# Altium schematic sheet fpga-bank6.SchDoc: FPGA - Bank 6
size Letter; CompanyName: Brinton Engineering, LLC; Address1: 3479 Edison Way; Address2: Menlo Park CA 94025; Address3: +1 (877) 778-8435; Address4: brintonengineering.com; Revision: 1; SheetNumber: 1; SheetTotal: 1
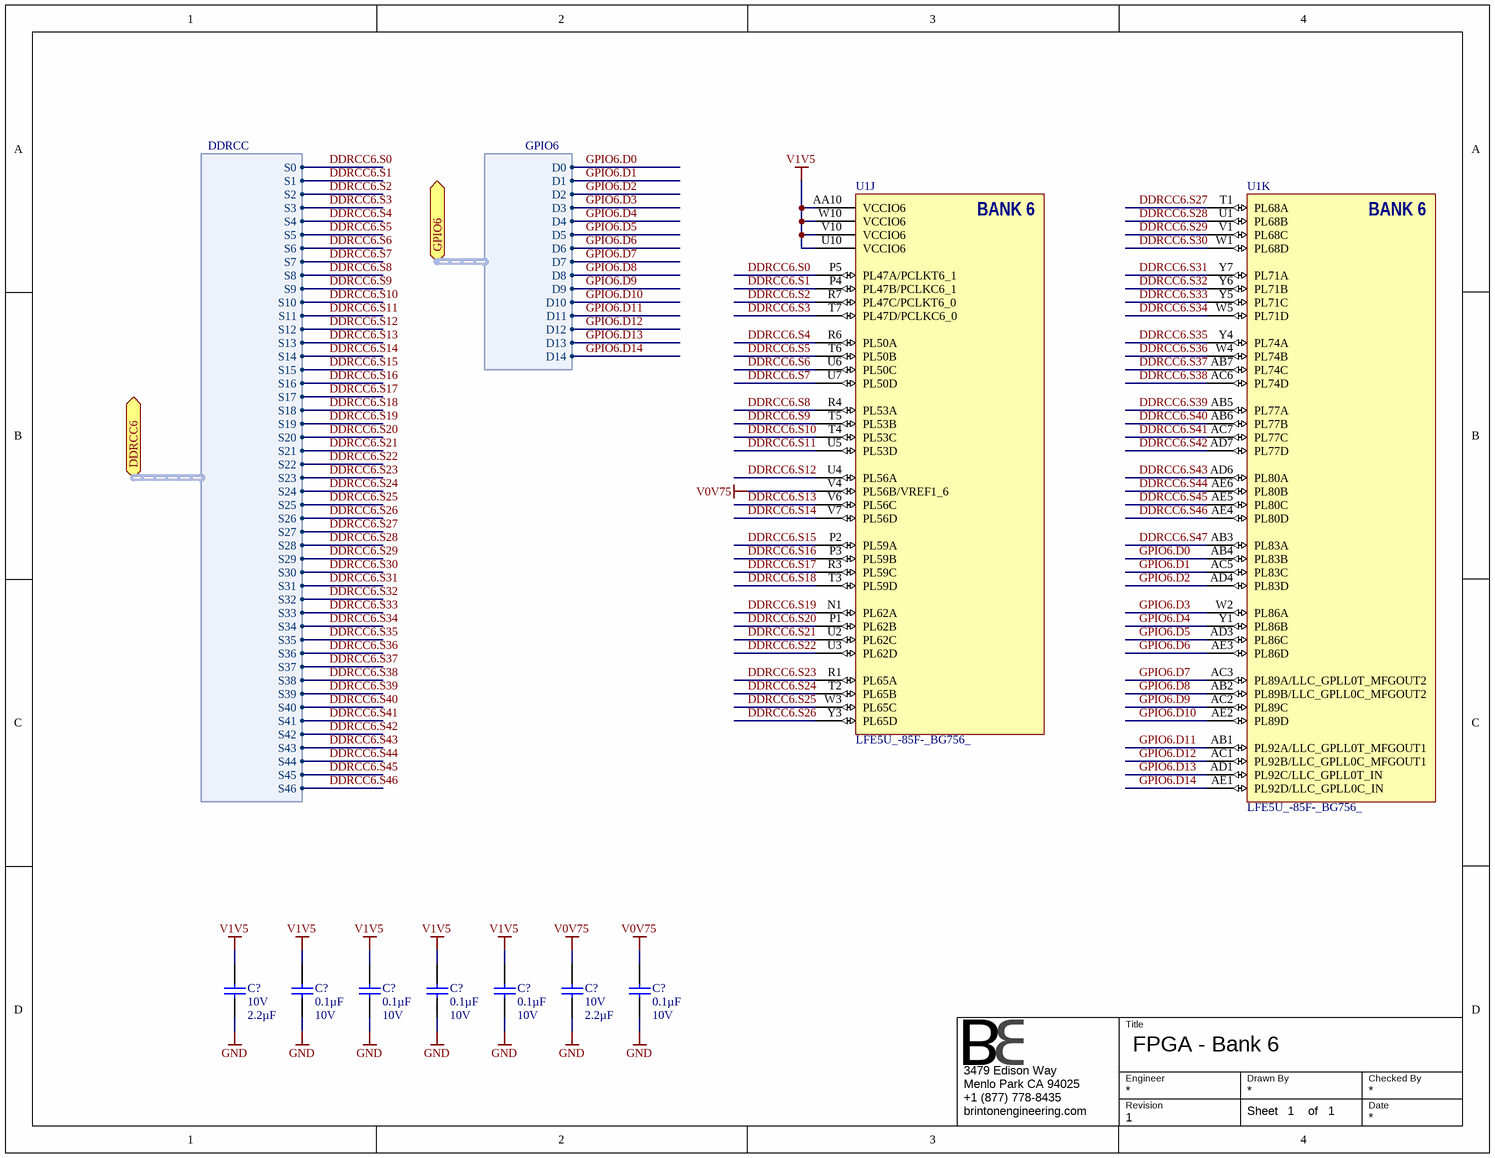
[diagram p0: fpga-bank6.SchDoc]

## Parts
(Parts that share a designator on the sheet are numbered #1, #2 ... from top to bottom, then left to right.)
C?#1  Voltage - Rated: 10V  Capacitance: 2.2µF  [CAPC1608X90N]  (hidden comment: GRM188R71A225KE15D)
C?#2  Capacitance: 0.1µF  Voltage - Rated: 10V  [CAPC1005X56N]  (hidden comment: GRM155R71A104KA01J)
C?#3  Capacitance: 0.1µF  Voltage - Rated: 10V  [CAPC1005X56N]  (hidden comment: GRM155R71A104KA01J)
C?#4  Capacitance: 0.1µF  Voltage - Rated: 10V  [CAPC1005X56N]  (hidden comment: GRM155R71A104KA01J)
C?#5  Capacitance: 0.1µF  Voltage - Rated: 10V  [CAPC1005X56N]  (hidden comment: GRM155R71A104KA01J)
C?#6  Voltage - Rated: 10V  Capacitance: 2.2µF  [CAPC1608X90N]  (hidden comment: GRM188R71A225KE15D)
C?#7  Capacitance: 0.1µF  Voltage - Rated: 10V  [CAPC1005X56N]  (hidden comment: GRM155R71A104KA01J)
U1  LFE5U_-85F-_BG756_  [caBGA756]  (parts J,K of 19)

## Ports
DDRCC6 (harness DDRCC), GPIO6 (harness GPIO6)

## Harnesses
DDRCC: S0, S1, S2, S3, S4, S5, S6, S7, S8, S9, S10, S11, S12, S13, S14, S15, S16, S17, S18, S19, S20, S21, S22, S23, S24, S25, S26, S27, S28, S29, S30, S31, S32, S33, S34, S35, S36, S37, S38, S39, S40, S41, S42, S43, S44, S45, S46
GPIO6: D0, D1, D2, D3, D4, D5, D6, D7, D8, D9, D10, D11, D12, D13, D14

## Nets
GND: C?#1.1 C?#2.1 C?#3.1 C?#4.1 C?#5.1 C?#6.1 C?#7.1
V0V75: C?#6.2 C?#7.2 U1.V4(PL56B/VREF1_6)
V1V5: C?#1.2 C?#2.2 C?#3.2 C?#4.2 C?#5.2 U1.AA10(VCCIO6) U1.U10(VCCIO6) U1.V10(VCCIO6) U1.W10(VCCIO6)
DDRCC6.S0: U1.P5(PL47A/PCLKT6_1) ; port DDRCC6.S0
DDRCC6.S1: U1.P4(PL47B/PCLKC6_1) ; port DDRCC6.S1
DDRCC6.S2: U1.R7(PL47C/PCLKT6_0) ; port DDRCC6.S2
DDRCC6.S3: U1.T7(PL47D/PCLKC6_0) ; port DDRCC6.S3
DDRCC6.S4: U1.R6(PL50A) ; port DDRCC6.S4
DDRCC6.S5: U1.T6(PL50B) ; port DDRCC6.S5
DDRCC6.S6: U1.U6(PL50C) ; port DDRCC6.S6
DDRCC6.S7: U1.U7(PL50D) ; port DDRCC6.S7
DDRCC6.S8: U1.R4(PL53A) ; port DDRCC6.S8
DDRCC6.S9: U1.T5(PL53B) ; port DDRCC6.S9
DDRCC6.S10: U1.T4(PL53C) ; port DDRCC6.S10
DDRCC6.S11: U1.U5(PL53D) ; port DDRCC6.S11
DDRCC6.S12: U1.U4(PL56A) ; port DDRCC6.S12
DDRCC6.S13: U1.V6(PL56C) ; port DDRCC6.S13
DDRCC6.S14: U1.V7(PL56D) ; port DDRCC6.S14
DDRCC6.S15: U1.P2(PL59A) ; port DDRCC6.S15
DDRCC6.S16: U1.P3(PL59B) ; port DDRCC6.S16
DDRCC6.S17: U1.R3(PL59C) ; port DDRCC6.S17
DDRCC6.S18: U1.T3(PL59D) ; port DDRCC6.S18
DDRCC6.S19: U1.N1(PL62A) ; port DDRCC6.S19
DDRCC6.S20: U1.P1(PL62B) ; port DDRCC6.S20
DDRCC6.S21: U1.U2(PL62C) ; port DDRCC6.S21
DDRCC6.S22: U1.U3(PL62D) ; port DDRCC6.S22
DDRCC6.S23: U1.R1(PL65A) ; port DDRCC6.S23
DDRCC6.S24: U1.T2(PL65B) ; port DDRCC6.S24
DDRCC6.S25: U1.W3(PL65C) ; port DDRCC6.S25
DDRCC6.S26: U1.Y3(PL65D) ; port DDRCC6.S26
DDRCC6.S27: U1.T1(PL68A) ; port DDRCC6.S27
DDRCC6.S28: U1.U1(PL68B) ; port DDRCC6.S28
DDRCC6.S29: U1.V1(PL68C) ; port DDRCC6.S29
DDRCC6.S30: U1.W1(PL68D) ; port DDRCC6.S30
DDRCC6.S31: U1.Y7(PL71A) ; port DDRCC6.S31
DDRCC6.S32: U1.Y6(PL71B) ; port DDRCC6.S32
DDRCC6.S33: U1.Y5(PL71C) ; port DDRCC6.S33
DDRCC6.S34: U1.W5(PL71D) ; port DDRCC6.S34
DDRCC6.S35: U1.Y4(PL74A) ; port DDRCC6.S35
DDRCC6.S36: U1.W4(PL74B) ; port DDRCC6.S36
DDRCC6.S37: U1.AB7(PL74C) ; port DDRCC6.S37
DDRCC6.S38: U1.AC6(PL74D) ; port DDRCC6.S38
DDRCC6.S39: U1.AB5(PL77A) ; port DDRCC6.S39
DDRCC6.S40: U1.AB6(PL77B) ; port DDRCC6.S40
DDRCC6.S41: U1.AC7(PL77C) ; port DDRCC6.S41
DDRCC6.S42: U1.AD7(PL77D) ; port DDRCC6.S42
DDRCC6.S43: U1.AD6(PL80A) ; port DDRCC6.S43
DDRCC6.S44: U1.AE6(PL80B) ; port DDRCC6.S44
DDRCC6.S45: U1.AE5(PL80C) ; port DDRCC6.S45
DDRCC6.S46: U1.AE4(PL80D) ; port DDRCC6.S46
DDRCC6.S47: U1.AB3(PL83A)
GPIO6.D0: U1.AB4(PL83B) ; port GPIO6.D0
GPIO6.D1: U1.AC5(PL83C) ; port GPIO6.D1
GPIO6.D2: U1.AD4(PL83D) ; port GPIO6.D2
GPIO6.D3: U1.W2(PL86A) ; port GPIO6.D3
GPIO6.D4: U1.Y1(PL86B) ; port GPIO6.D4
GPIO6.D5: U1.AD3(PL86C) ; port GPIO6.D5
GPIO6.D6: U1.AE3(PL86D) ; port GPIO6.D6
GPIO6.D7: U1.AC3(PL89A/LLC_GPLL0T_MFGOUT2) ; port GPIO6.D7
GPIO6.D8: U1.AB2(PL89B/LLC_GPLL0C_MFGOUT2) ; port GPIO6.D8
GPIO6.D9: U1.AC2(PL89C) ; port GPIO6.D9
GPIO6.D10: U1.AE2(PL89D) ; port GPIO6.D10
GPIO6.D11: U1.AB1(PL92A/LLC_GPLL0T_MFGOUT1) ; port GPIO6.D11
GPIO6.D12: U1.AC1(PL92B/LLC_GPLL0C_MFGOUT1) ; port GPIO6.D12
GPIO6.D13: U1.AD1(PL92C/LLC_GPLL0T_IN) ; port GPIO6.D13
GPIO6.D14: U1.AE1(PL92D/LLC_GPLL0C_IN) ; port GPIO6.D14

## Notes on the sheet
- Title
- Engineer
- Revision
- Drawn By
- Checked By
- Date
- Sheet
- of
- (in symbol LFE5U_-85F-_BG756_, part J) BANK 6
- (in symbol LFE5U_-85F-_BG756_, part K) BANK 6

## Library data of the parts
C?#1 C?#6 = GRM188R71A225KE15D: CAP CER 2.2UF 10V 10% X7R 0603; Manufacturer: Murata Electronics North America; Manufacturer P/N: GRM188R71A225KE15D; Operating Temperature: -55°C ~ 125°C; Thickness (Max): 0.035" (0.90mm); Tolerance: ±10%; Package / Case: 0603 (1608 Metric); Temperature Coefficient: X7R; Supplier 1: Newark; Supplier 2: Digi-Key; RoHS: RoHS Compliant; Size / Dimension: 0.063" L x 0.031" W (1.60mm x 0.80mm); Mounting Type: Surface Mount, MLCC; ComponentLink1URL: http://www.murata.com/~/media/webrenewal/support/library/catalog/products/capacitor/mlcc/c02e.ashx; ComponentLink1Description: http://www.murata.com/~/media/webrenewal/support/library/catalog/products/capacitor/mlcc/c02e.ashx; Supplier Part Number 1: 72R4209; Supplier Part Number 2: 490-4520-1-ND
C?#2-C?#5 C?#7 = GRM155R71A104KA01J: CAP CER 0.1UF 10V 10% X7R 0402; Manufacturer: Murata Electronics North America; Manufacturer P/N: GRM155R71A104KA01J; Operating Temperature: -55°C ~ 125°C; Thickness (Max): 0.022" (0.55mm); Size / Dimension: 0.039" L x 0.020" W (1.00mm x 0.50mm); RoHS: RoHS Compliant; Mounting Type: Surface Mount, MLCC; Supplier 1: Digi-Key; ComponentLink1URL: http://www.murata.com/~/media/webrenewal/support/library/catalog/products/capacitor/mlcc/c02e.ashx; ComponentLink1Description: http://www.murata.com/~/media/webrenewal/support/library/catalog/products/capacitor/mlcc/c02e.ashx; Supplier Part Number 1: 490-6322-1-ND; Temperature Coefficient: X7R; Package / Case: 0402 (1005 Metric); Tolerance: ±10%
U1 = LFE5U_-85F-_BG756_: ECP5 FPGA, 85k LUT, 756-caBGA; Manufacturer: Lattice Semiconductor; Manufacturer P/N: LFE5U_-85F-_BG756_